# EAGLE design omaha_final (EAGLE 7.5.0)
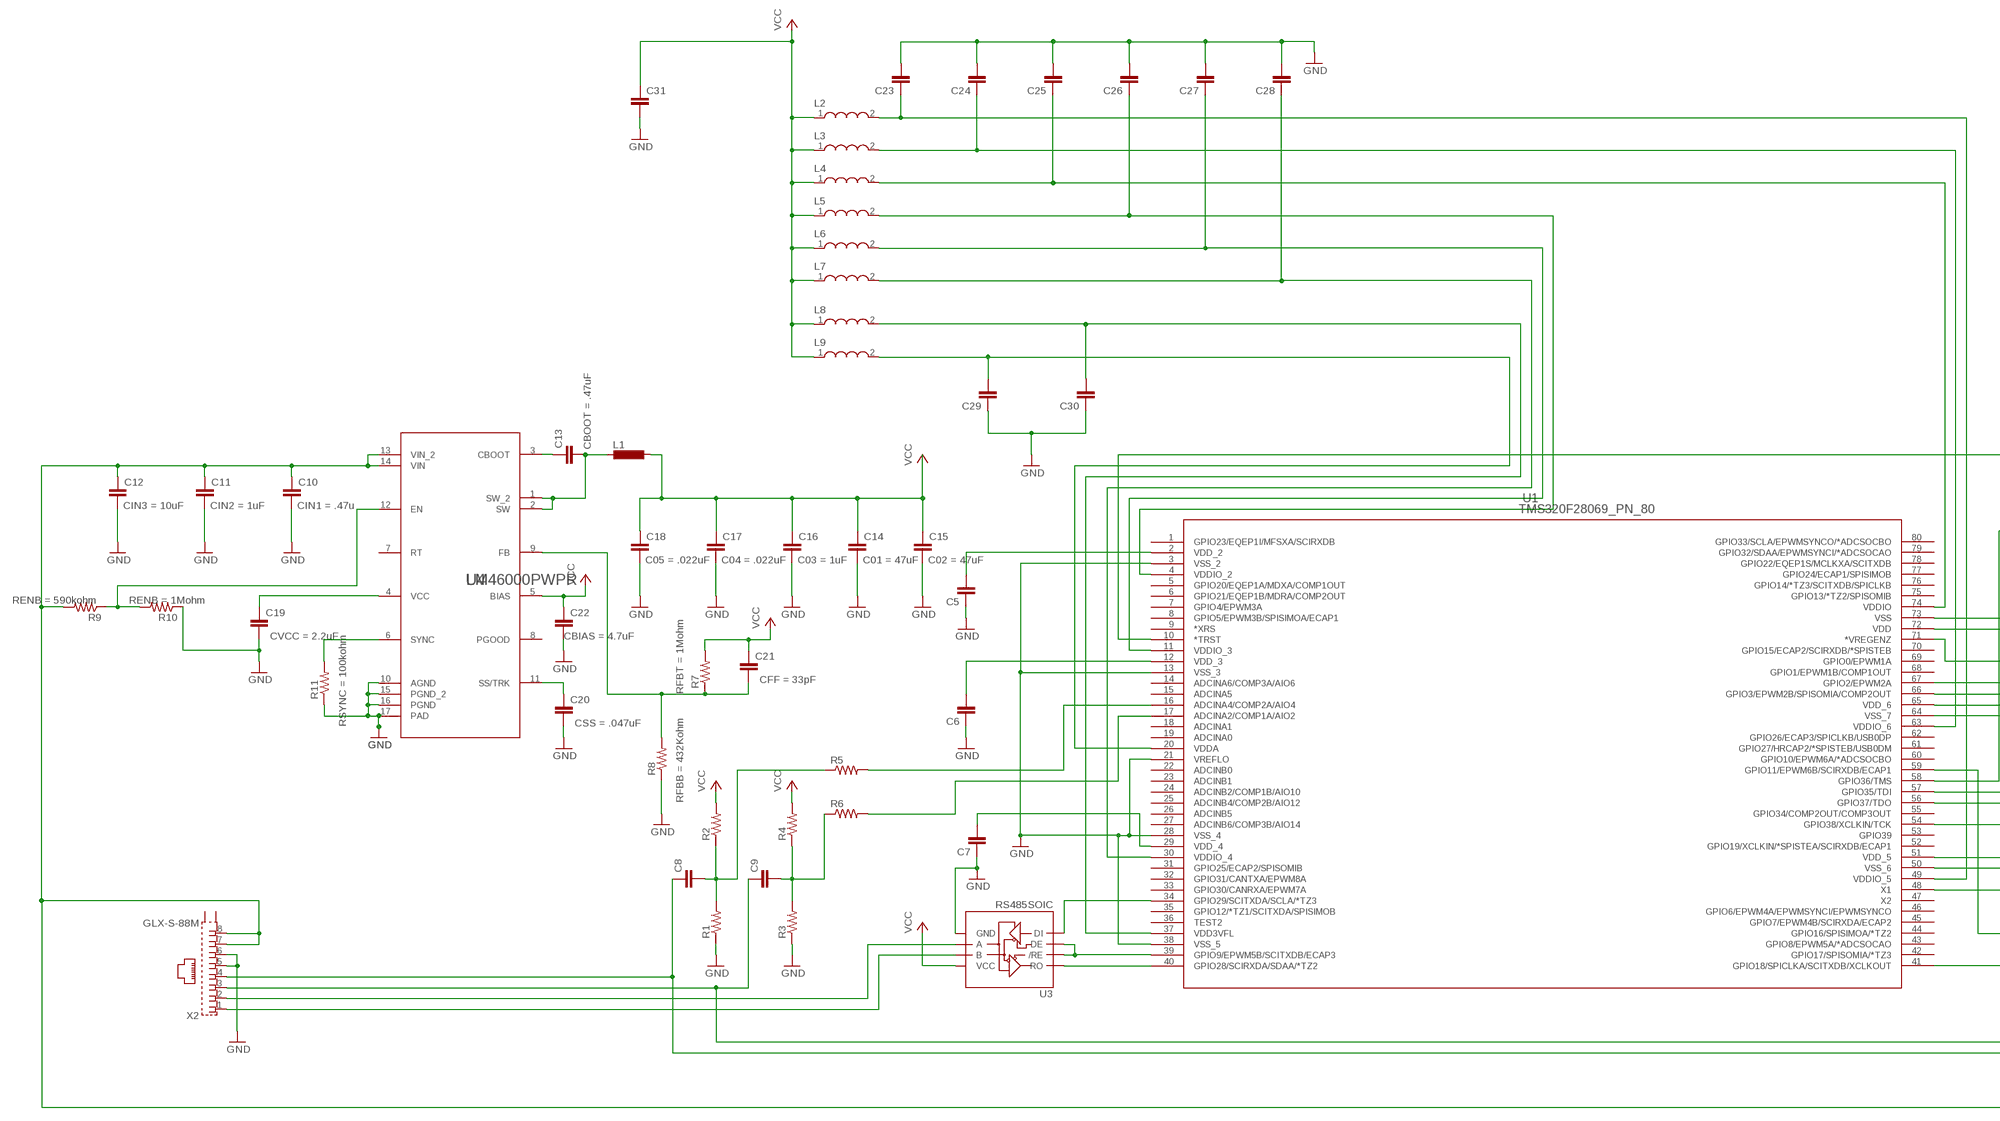
[diagram p0: schematic, sheet 1, part 1 of 2]
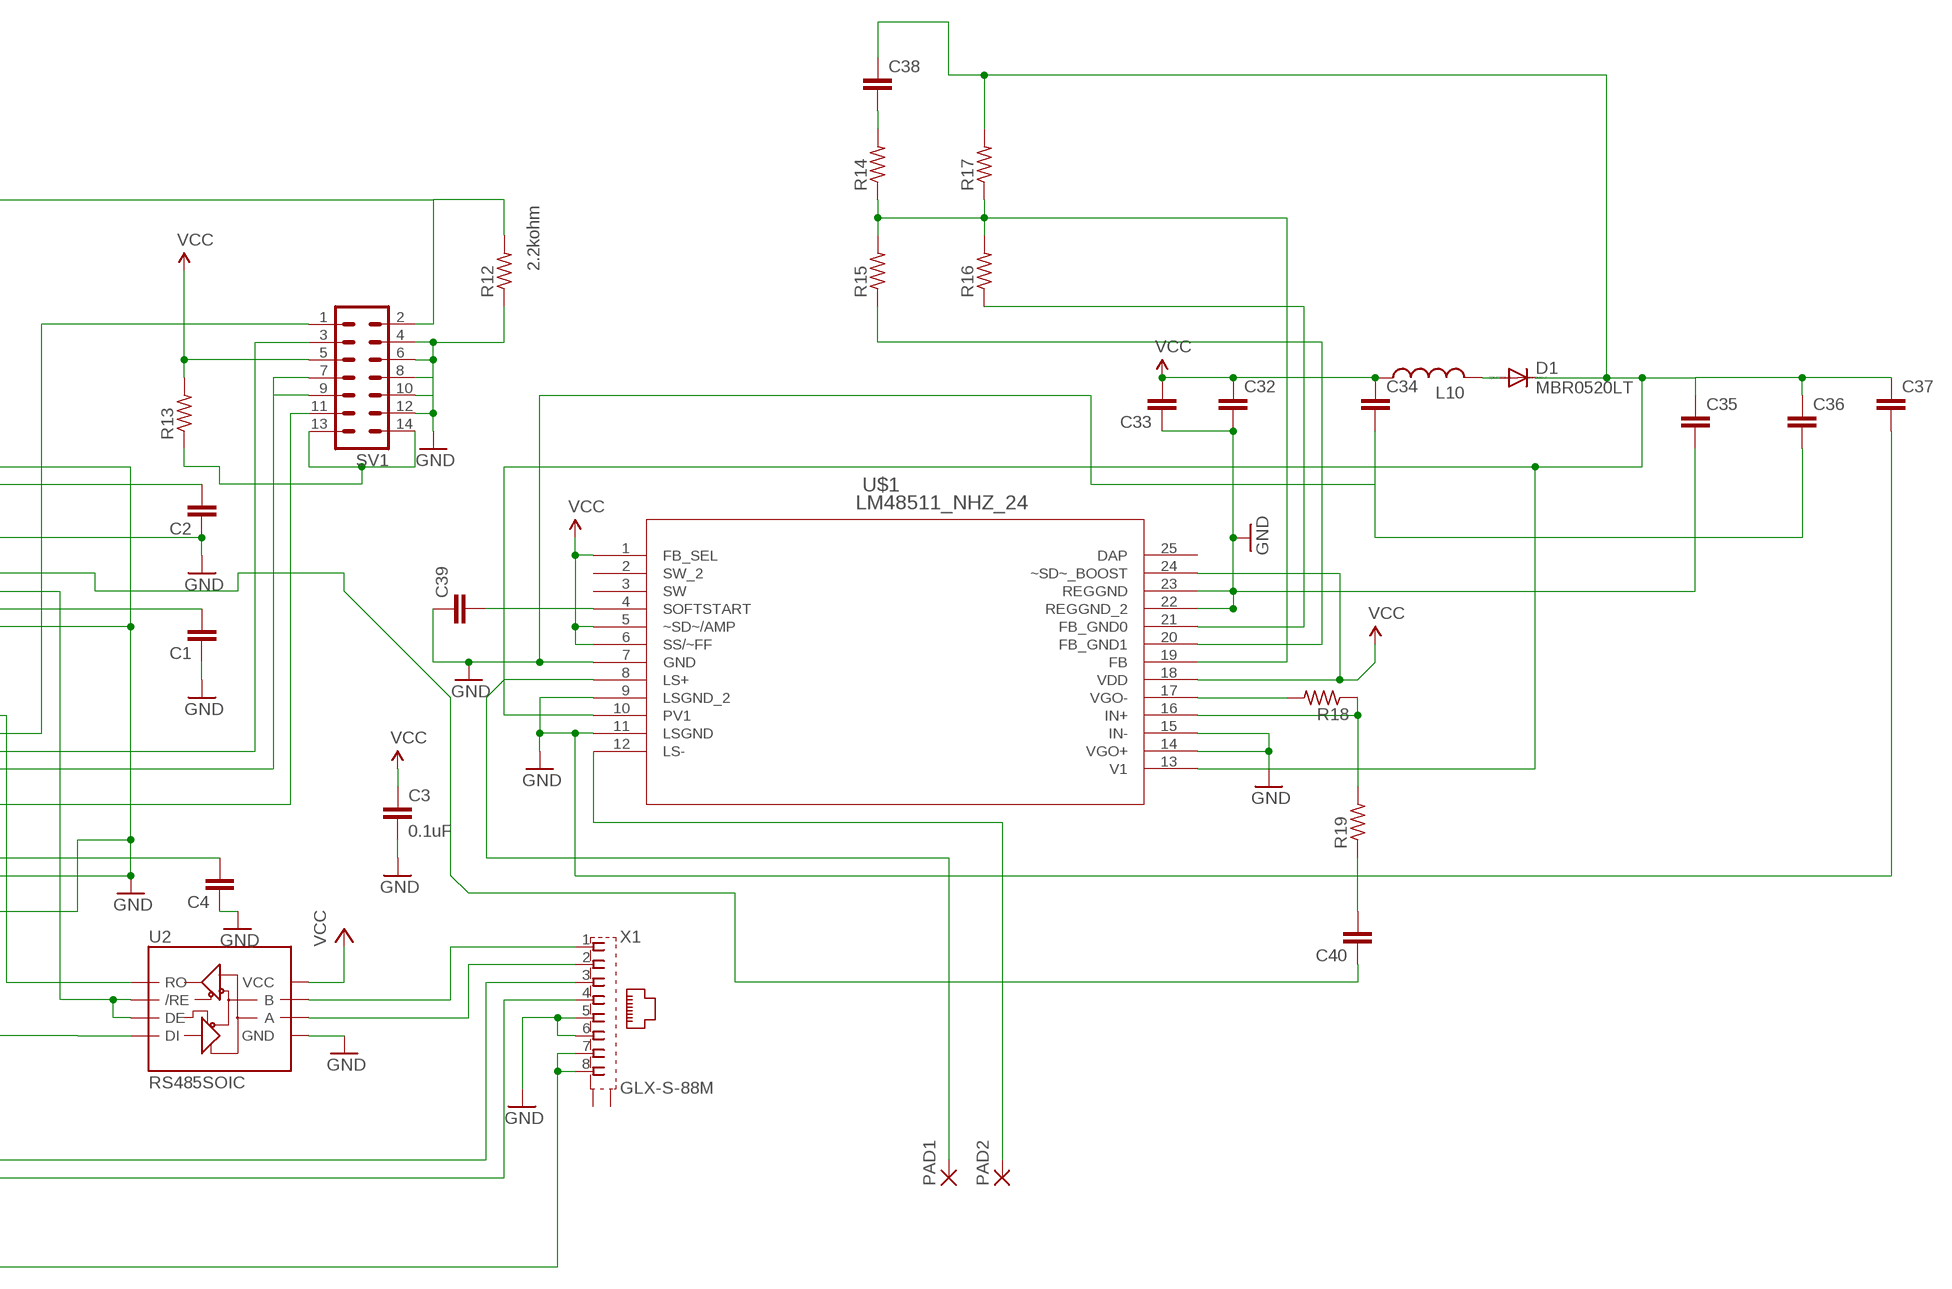
[diagram p1: schematic, sheet 1, part 2 of 2]

## Parts
C1  C-EUC0603  [C0603]
C2  C-EUC0603  [C0603]
C3  0.1uF  0.1UF-25V(+80/-20%)(0603)  [0603-CAP]
C4  C-EUC0603  [C0603]
C5  C-EUC0603  [C0603]
C6  C-EUC0603  [C0603]
C7  C-EUC0603  [C0603]
C8  C-EUC0603  [C0603]
C9  C-EUC0603  [C0603]
C10  C-EUC0805  [C0805]
C11  C-EUC1210  [C1210]
C12  C-EUC2220K  [C2220K]
C13  C-EUC0805  [C0805]
C14  C-EUC1210  [C1210]
C15  C-EUC1210  [C1210]
C16  C-EUC0805  [C0805]
C17  C-EUC0805  [C0805]
C18  C-EUC0805  [C0805]
C19  C-EUC0603  [C0603]
C20  C-EUC0603  [C0603]
C21  C-EUC0603  [C0603]
C22  C-EUC0805  [C0805]
C23  C-EUC0603  [C0603]
C24  C-EUC0603  [C0603]
C25  C-EUC0603  [C0603]
C26  C-EUC0603  [C0603]
C27  C-EUC0603  [C0603]
C28  C-EUC0603  [C0603]
C29  C-EUC0603  [C0603]
C30  C-EUC0603  [C0603]
C31  C-EUC0603  [C0603]
C32  C-EUC0805  [C0805]
C33  C-EUC0805  [C0805]
C34  C-EUC0805  [C0805]
C35  C-EUC0805  [C0805]
C36  C-EUC0805  [C0805]
C37  C-EUC0805  [C0805]
C38  C-EUC0805  [C0805]
C39  C-EUC0805  [C0805]
C40  C-EUC0805  [C0805]
D1  MBR0520LT  [SOD123]
L1  DO3316P  [DO3316P]
L2  WE-KI_0805A  [WE-KI_0805A]
L3  WE-KI_0805A  [WE-KI_0805A]
L4  WE-KI_0805A  [WE-KI_0805A]
L5  WE-KI_0805A  [WE-KI_0805A]
L6  WE-KI_0805A  [WE-KI_0805A]
L7  WE-KI_0805A  [WE-KI_0805A]
L8  WE-KI_0805A  [WE-KI_0805A]
L9  WE-KI_0805A  [WE-KI_0805A]
L10  L-USL5650M  [L5650M]
PAD1  3,81/1,4  [3,81/1,4]
PAD2  3,81/1,4  [3,81/1,4]
R1  R-US_R0603  [R0603]
R2  R-US_R0603  [R0603]
R3  R-US_R0603  [R0603]
R4  R-US_R0603  [R0603]
R5  R-US_R0603  [R0603]
R6  R-US_R0603  [R0603]
R7  R-US_R0603  [R0603]
R8  R-US_R0603  [R0603]
R9  R-US_R0603  [R0603]
R10  R-US_R0603  [R0603]
R11  R-US_R0603  [R0603]
R12  R-US_R0603  [R0603]
R13  R-US_R0603  [R0603]
R14  R-US_R0805  [R0805]
R15  R-US_R0805  [R0805]
R16  R-US_R0805  [R0805]
R17  R-US_R0805  [R0805]
R18  R-US_R0805  [R0805]
R19  R-US_R0805  [R0805]
SV1  MA07-2W  [MA07-2W]
U1  TMS320F28069_PN_80  [PN80]
U2  RS485SOIC  [SO08]
U3  RS485SOIC  [SO08]
U4  LM46000PWPR  [PWP0016F]
U$1  LM48511_NHZ_24  [SQA24B]
X1  GLX-S-88M  [GLX-S-88M]
X2  GLX-S-88M  [GLX-S-88M]

## Nets
GND [power]: C1.1 C2.1 C3.2 C4.1 C5.1 C6.1 C7.1 C10.2 C11.2 C12.2 C14.2 C15.2 C16.2 C17.2 C18.2 C19.2 C20.2 C22.2 C23.2 C24.2 C25.2 C26.2 C27.2 C28.2 C29.1 C30.1 C31.2 C32.2 C33.1 C34.2 C35.2 C36.2 C37.2 C39.1 R1.1 R3.1 R8.1 R10.1 R11.1 R12.1 SV1.4 SV1.6 SV1.8 SV1.10 SV1.12 U1.3(VSS_2) U1.13(VSS_3) U1.21(VREFLO) U1.28(VSS_4) U1.38(VSS_5) U1.48(X1) U1.50(VSS_6) U1.64(VSS_7) U1.71(*VREGENZ) U1.73(VSS) U2.5(GND) U3.5(GND) U4.10(AGND) U4.15(PGND_2) U4.16(PGND) U4.17(PAD) U$1.7(GND) U$1.9(LSGND_2) U$1.11(LSGND) U$1.14(VGO+) U$1.15(IN-) U$1.22(REGGND_2) U$1.23(REGGND) X1.5 X1.6 X2.5 X2.6
N$1: U1.59(GPIO11/EPWM6B/SCIRXDB/ECAP1) U2.1(RO)
N$2: U1.34(GPIO29/SCITXDA/SCLA/*TZ3) U3.4(DI)
N$4: U1.41(GPIO18/SPICLKA/SCITXDB/XCLKOUT) U2.4(DI)
N$5: U1.40(GPIO28/SCIRXDA/SDAA/*TZ2) U3.1(RO)
N$6: C1.2 U1.65(VDD_6)
N$7: C2.2 U1.72(VDD)
N$8: C4.2 U1.51(VDD_5)
N$9: C5.2 U1.2(VDD_2)
N$10: C6.2 U1.12(VDD_3)
N$11: C7.2 U1.29(VDD_4)
N$12: U2.7(B) X1.1
N$13: U2.6(A) X1.2
N$14: U3.7(B) X2.1
N$15: U3.6(A) X2.2
N$16: C9.1 X1.3 X2.3
N$17: C8.1 X1.4 X2.4
N$18: C8.2 R1.2 R2.1 R5.1
N$19: C9.2 R3.2 R4.1 R6.1
N$20: R6.2 U1.17(ADCINA2/COMP1A/AIO2)
N$21: R5.2 U1.16(ADCINA4/COMP2A/AIO4)
N$22: C13.2 L1.1 U4.1(SW_2) U4.2(SW)
N$23: C10.1 C11.1 C12.1 R9.2 U4.13(VIN_2) U4.14(VIN) X1.7 X1.8 X2.7 X2.8
N$24: C13.1 U4.3(CBOOT)
N$25: C19.1 U4.4(VCC)
N$26: C20.1 U4.11(SS/TRK)
N$27: C21.2 R7.1 R8.2 U4.9(FB)
N$28: R9.1 R10.2 U4.12(EN)
N$29: R11.2 U4.6(SYNC)
N$30: SV1.3 U1.57(GPIO35/TDI)
N$31: C24.1 L3.2 U1.63(VDDIO_6)
N$32: C28.1 L7.2 U1.30(VDDIO_4)
N$33: C25.1 L4.2 U1.74(VDDIO)
N$34: SV1.7 SV1.9 U1.56(GPIO37/TDO)
N$35: SV1.11 U1.54(GPIO38/XCLKIN/TCK)
N$36: C30.2 L8.2 U1.37(VDD3VFL)
N$37: R13.1 SV1.13 SV1.14
N$38: C27.1 L6.2 U1.11(VDDIO_3)
N$39: C26.1 L5.2 U1.4(VDDIO_2)
N$40: C29.2 L9.2 U1.20(VDDA)
N$41: C23.1 L2.2 U1.49(VDDIO_5)
N$42: R12.2 SV1.2 U1.10(*TRST)
N$44: SV1.1 U1.58(GPIO36/TMS)
N$45: U1.39(GPIO9/EPWM5B/SCITXDB/ECAP3) U3.2(/RE) U3.3(DE)
N$46: D1.A L10.2
N$47: C35.1 C36.1 C37.1 C38.1 D1.C R17.2 U$1.10(PV1) U$1.13(V1)
N$50: C40.2 R19.1
N$52: C38.2 R14.2
N$53: R14.1 R15.2 R16.2 R17.1 U$1.19(FB)
N$54: C40.1 U1.67(GPIO2/EPWM2A)
N$55: R16.1 U$1.21(FB_GND0)
N$56: R15.1 U$1.20(FB_GND1)
N$57: C39.2 U$1.4(SOFTSTART)
N$58: R18.2 U$1.17(VGO-)
N$59: R18.1 R19.2 U$1.16(IN+)
N$61: PAD1.1(P) U$1.8(LS+)
N$62: PAD2.1(P) U$1.12(LS-)
RTS: U1.66(GPIO3/EPWM2B/SPISOMIA/COMP2OUT) U2.2(/RE) U2.3(DE)
VCC [power]: C3.1 C14.1 C15.1 C16.1 C17.1 C18.1 C21.1 C22.1 C31.1 C32.1 C33.2 C34.1 L1.2 L2.1 L3.1 L4.1 L5.1 L6.1 L7.1 L8.1 L9.1 L10.1 R2.2 R4.2 R7.2 R13.2 SV1.5 U2.8(VCC) U3.8(VCC) U4.5(BIAS) U$1.1(FB_SEL) U$1.5(~SD~/AMP) U$1.6(SS/~FF) U$1.18(VDD) U$1.24(~SD~_BOOST)
Unconnected: U1.1(GPIO23/EQEP1I/MFSXA/SCIRXDB) U1.5(GPIO20/EQEP1A/MDXA/COMP1OUT) U1.6(GPIO21/EQEP1B/MDRA/COMP2OUT) U1.7(GPIO4/EPWM3A) U1.8(GPIO5/EPWM3B/SPISIMOA/ECAP1) U1.9(*XRS) U1.14(ADCINA6/COMP3A/AIO6) U1.15(ADCINA5) U1.18(ADCINA1) U1.19(ADCINA0) U1.22(ADCINB0) U1.23(ADCINB1) U1.24(ADCINB2/COMP1B/AIO10) U1.25(ADCINB4/COMP2B/AIO12) U1.26(ADCINB5) U1.27(ADCINB6/COMP3B/AIO14) U1.31(GPIO25/ECAP2/SPISOMIB) U1.32(GPIO31/CANTXA/EPWM8A) U1.33(GPIO30/CANRXA/EPWM7A) U1.35(GPIO12/*TZ1/SCITXDA/SPISIMOB) U1.36(TEST2) U1.42(GPIO17/SPISOMIA/*TZ3) U1.43(GPIO8/EPWM5A/*ADCSOCAO) U1.44(GPIO16/SPISIMOA/*TZ2) U1.45(GPIO7/EPWM4B/SCIRXDA/ECAP2) U1.46(GPIO6/EPWM4A/EPWMSYNCI/EPWMSYNCO) U1.47(X2) U1.52(GPIO19/XCLKIN/*SPISTEA/SCIRXDB/ECAP1) U1.53(GPIO39) U1.55(GPIO34/COMP2OUT/COMP3OUT) U1.60(GPIO10/EPWM6A/*ADCSOCBO) U1.61(GPIO27/HRCAP2/*SPISTEB/USB0DM) U1.62(GPIO26/ECAP3/SPICLKB/USB0DP) U1.68(GPIO1/EPWM1B/COMP1OUT) U1.69(GPIO0/EPWM1A) U1.70(GPIO15/ECAP2/SCIRXDB/*SPISTEB) U1.75(GPIO13/*TZ2/SPISOMIB) U1.76(GPIO14/*TZ3/SCITXDB/SPICLKB) U1.77(GPIO24/ECAP1/SPISIMOB) U1.78(GPIO22/EQEP1S/MCLKXA/SCITXDB) U1.79(GPIO32/SDAA/EPWMSYNCI/*ADCSOCAO) U1.80(GPIO33/SCLA/EPWMSYNCO/*ADCSOCBO) U4.7(RT) U4.8(PGOOD) U$1.2(SW_2) U$1.3(SW) X1.S1 X1.S2 X2.S1 X2.S2

## Power pins joined to a net without a drawn wire
DAP: U$1.25(DAP)

## Library data of the parts
C1 C2 C4-C9 C23-C40 = resistor:C-EU: CAPACITOR, European symbol
C3 = SparkFun-Capacitors:0.1UF-25V(+80/-20%)(0603): CAP-00810 Ceramic Standard decoupling cap; PROD_ID: CAP-00810
C10 = resistor:C-EU: CAPACITOR, European symbol; CIN1: .47u
C11 = resistor:C-EU: CAPACITOR, European symbol; CIN2: 1uF
C12 = resistor:C-EU: CAPACITOR, European symbol; CIN3: 10uF
C13 = resistor:C-EU: CAPACITOR, European symbol; CBOOT: .47uF
C14 = resistor:C-EU: CAPACITOR, European symbol; C01: 47uF
C15 = resistor:C-EU: CAPACITOR, European symbol; C02: 47uF
C16 = resistor:C-EU: CAPACITOR, European symbol; C03: 1uF
C17 = resistor:C-EU: CAPACITOR, European symbol; C04: .022uF
C18 = resistor:C-EU: CAPACITOR, European symbol; C05: .022uF
C19 = resistor:C-EU: CAPACITOR, European symbol; CVCC: 2.2uF
C20 = resistor:C-EU: CAPACITOR, European symbol; CSS: .047uF
C21 = resistor:C-EU: CAPACITOR, European symbol; CFF: 33pF
C22 = resistor:C-EU: CAPACITOR, European symbol; CBIAS: 4.7uF
D1 = diode:MBR0520LT: SCHOTTKY BARRIER RECTIFIER Source: http://onsemi.com .. MBR0520LT1-D.pdf
L1 = inductor-coilcraft:DO3316P: COILCRAFT; OC_FARNELL: unknown; OC_NEWARK: unknown
L2-L9 = EagleLibrary_Wuerth_Elektronik_eiSos_rev15h:WE-KI: SMD Wire Wound Ceramic Inductor Characteristics WE-KI series offers you an excellent Q factor and highest possible self resonant frequencies up to 12.5 GHz Inductance tolerances: 5% (2% on request) High thermal stability Operating temperature: –40°C to +125°C Applications Especially developed for high frequency applications RF transceiver/communications Bluetooth Wireless LAN <http://katalog.we-online.de/media/images/eisos/RfKI_pf2.jpg> Details see: http://katalog.we-online.de/en/pbs/WE-KI Updated by Dan Xu 2014-07-08 2014 (C) Wurth Elektronik
L10 = resistor:L-US: INDUCTOR, American symbol
PAD1 PAD2 = wirepad:3,81/1,4: THROUGH-HOLE PAD
R1-R6 R14-R19 = resistor:R-US_: RESISTOR, American symbol
R7 = resistor:R-US_: RESISTOR, American symbol; RFBT: 1Mohm
R8 = resistor:R-US_: RESISTOR, American symbol; RFBB: 432Kohm
R9 = resistor:R-US_: RESISTOR, American symbol; RENB: 590kohm
R10 = resistor:R-US_: RESISTOR, American symbol; RENB: 1Mohm
R11 = resistor:R-US_: RESISTOR, American symbol; RSYNC: 100kohm
R12 = resistor:R-US_: RESISTOR, American symbol; R12: 2.2kohm
R13 = resistor:R-US_: RESISTOR, American symbol; R13: 2.2kohm
SV1 = con-lstb:MA07-2W: PIN HEADER; OC_FARNELL: unknown; OC_NEWARK: unknown
U1 = tms320f28069:TMS320F28069_PN_80; DATASHEETURL: http://www.ti.com/lit/gpn/TMS320F28069; DESCRIPTION: Piccolo Microcontroller; FAMILY_NAME: 28X PICCOLO&#153 SERIES; GENERIC_PART_NUMBER: TMS320F28069; INDUSTRY_STD_PKG_TYPE: LQFP; MANUFACTURER: Texas Instruments; MANUFACTURER_PART_NUMBER: tms320f28069_pn_80; PACKAGE_DESIGNATOR: PN; PIN_COUNT: 80; VENDOR: Texas Instruments
U2 U3 = SparkFun:RS485
U4 = lm46000:LM46000PWPR; ADDRESS1: Not shown in title block; ADDRESS2: Not shown in title block; ADDRESS3: Not shown in title block; ADDRESS4: Not shown in title block; ALTERNATEMANUFACTURER: None; APPROVEDBY: Not shown in title block; AUTHOR: Not shown in title block; CHECKEDBY: Not shown in title block; COMPANYNAME: Not shown in title block; COMPONENTLINK1DESCRIPTION: Datasheet Link; COMPONENTLINK1URL: N/A; COMPTYPE: IC; CURRENTDATE: Not shown in title block; CURRENTTIME: Not shown in title block; DATE: Not shown in title block; DESIGNATOR: U?; DOCUMENTFULLPATHANDNAME: Not shown in title block; DOCUMENTNAME: Not shown in title block; DOCUMENTNUMBER: 1; ENGINEER: Not shown in title block; IMAGEPATH: Not shown in title block; LATESTREVISIONDATE: 2014-02-20; MANUFACTURER: Texas Instruments; MODIFIEDDATE: Not shown in title block; MOUNTTYPE: SMT; ORGANIZATION: Not shown in title block; PACKAGEREFERENCE: PWP0016F; PARTNUMBER: LM46000PWP; PIN_COUNT: 17; PROJECTNAME: *; PUBLISHER: Texas Instruments; REVISION: Use project parameter SCH_Rev; ROHS: Y; RULE: *; SHEETNUMBER: 1; SHEETTOTAL: 1; SYMBOLCREATOR: x0208326; SYMBOLVERSION: 2014-02-14; TIME: Not shown in title block
U$1 = amp:LM48511_NHZ_24; MANUFACTURER_PART_NUMBER: lm48511sqnopb; VENDOR: National
X1 X2 = con-kycon:GLX-S-88M: Mod. Jack, Right Angle, 8 posiotion, 8 contatcs RJ45 Source: GLX-S-88M.pdf; OC_FARNELL: unknown; OC_NEWARK: unknown

## Net classes
0 default: width 0.203 mm
1 power: width 0.254 mm

## Board
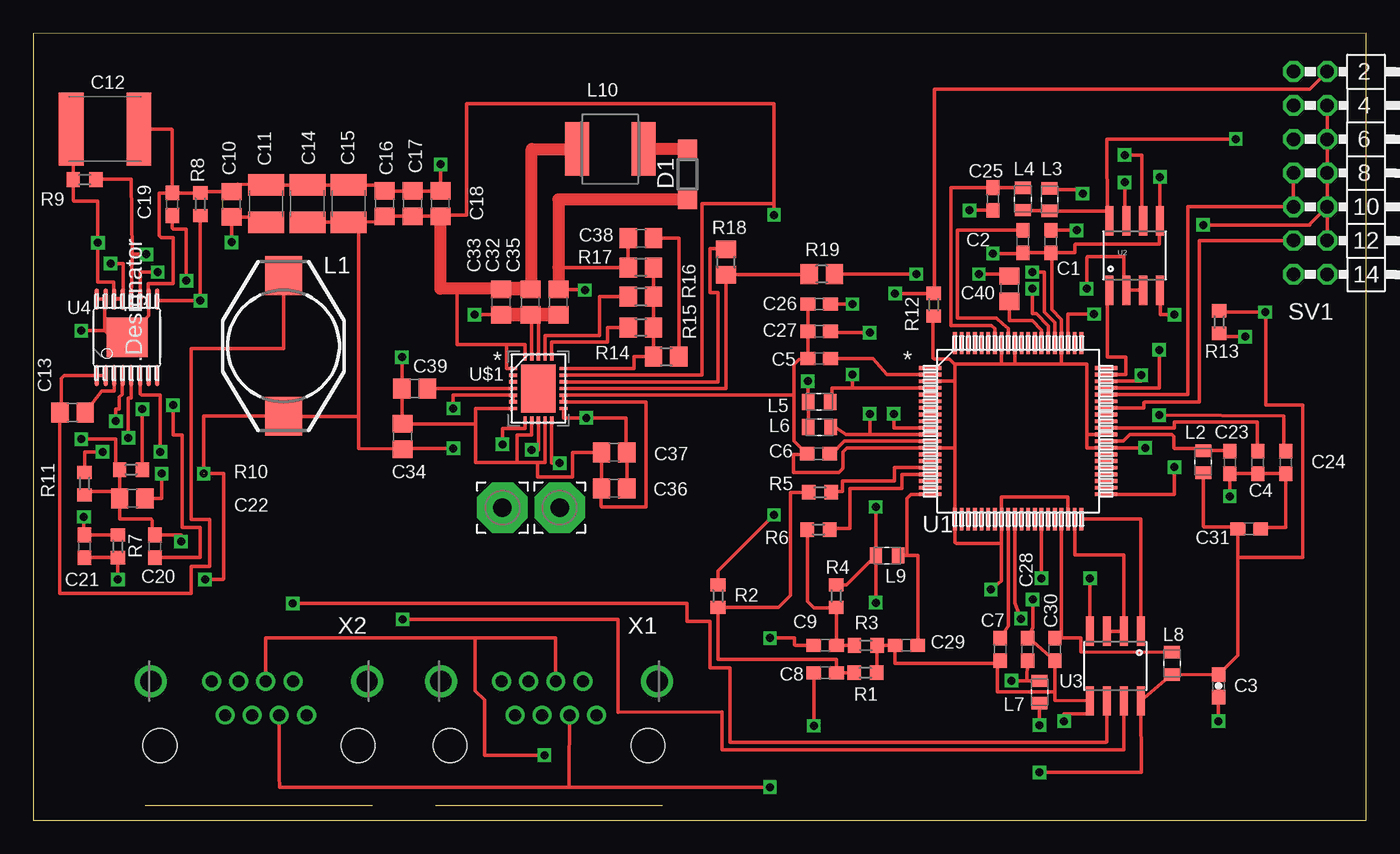
[diagram p2: board, top side]
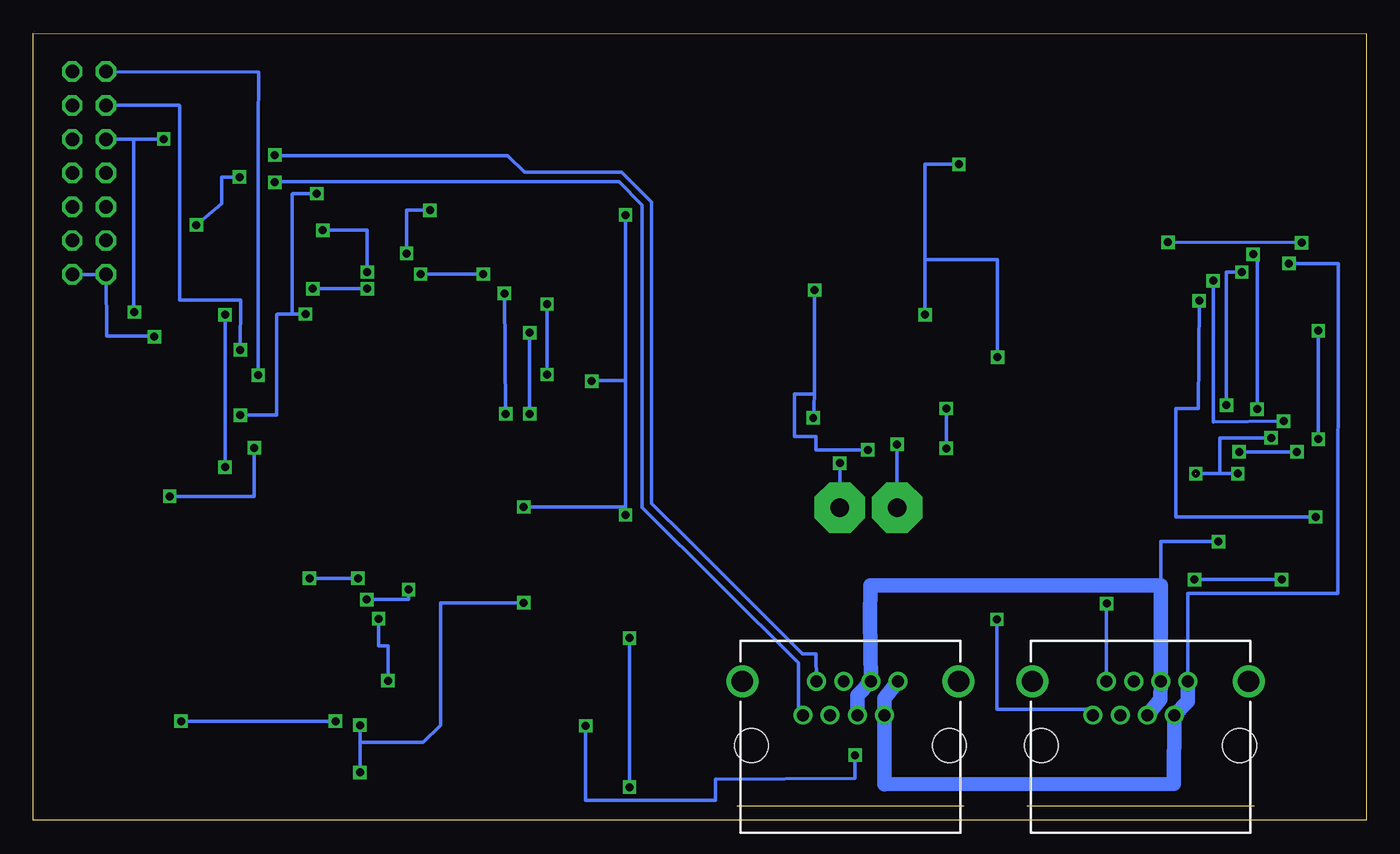
[diagram p3: board, bottom side, seen from below]

Size 100.15 x 59.15 mm. Coordinates in mm from the lower left corner, seen from the top.
Outline: 0,0 100.15,0 100.15,59.15 0,59.1 0,0
Copper layers (1*16): Top 0.035mm / dielectric 1.5mm / Bottom 0.035mm
Design rules "default *": minimum track width 10mil, minimum drill 24mil, track to track 8mil, track to pad 8mil, pad to pad 8mil, via to via 8mil, smd to smd 8mil, copper to edge 40mil, drill to drill 8mil, minimum pad ring 10mil, minimum via ring 8mil, stop-mask expansion 4mil, vias tented up to drill 0mil, thermal gap 10mil

### Footprints (pad centres in the part's own frame; a part is rotated, then mirrored left to right if it is on the bottom)
C0603 = smd 1.1 x 1: 1 -0.85,0; 2 0.85,0
0603-CAP = smd 1.1 x 1: 1 -0.85,0; 2 0.85,0
C0805 = smd 1.3 x 1.5: 1 -0.95,0; 2 0.95,0
C1210 = smd 1.6 x 2.7: 1 -1.4,0; 2 1.4,0
C2220K = smd 1.85 x 5.5: 1 -2.55,0; 2 2.55,0
SOD123 = smd 1.4 x 1.4: A 1.9,0; C -1.9,0
DO3316P = smd 2.92 x 2.79: 1 -5.28,0; 2 5.28,0
WE-KI_0805A = smd 0.925 x 1.2: 1 -0.838,0; 2 0.838,0
L5650M = smd 1.8 x 4: 1 -2.5,0; 2 2.5,0
3,81/1,4 = drill 1.397 pad 3.81 octagon: 1 0,0
R0603 = smd 1 x 1.1: 1 -0.85,0; 2 0.85,0
R0805 = smd 1.3 x 1.5: 1 -0.95,0; 2 0.95,0
MA07-2W = drill 1.016 octagon: 1 -7.62,-1.27; 2 -7.62,1.27; 3 -5.08,-1.27; 4 -5.08,1.27; 5 -2.54,-1.27; 6 -2.54,1.27; 7 0,-1.27; 8 0,1.27; 9 2.54,-1.27; 10 2.54,1.27; 11 5.08,-1.27; 12 5.08,1.27; 13 7.62,-1.27; 14 7.62,1.27
PN80 = smd 1.676 x 0.279: 1 -6.617,4.75; 2 -6.617,4.25; 3 -6.617,3.75; 4 -6.617,3.25; 5 -6.617,2.75; 6 -6.617,2.25; 7 -6.617,1.75; 8 -6.617,1.25; 9 -6.617,0.75; 10 -6.617,0.25; 11 -6.617,-0.25; 12 -6.617,-0.75; 13 -6.617,-1.25; 14 -6.617,-1.75; 15 -6.617,-2.25; 16 -6.617,-2.75; 17 -6.617,-3.25; 18 -6.617,-3.75; 19 -6.617,-4.25; 20 -6.617,-4.75; 41 6.617,-4.75; 42 6.617,-4.25; 43 6.617,-3.75; 44 6.617,-3.25; 45 6.617,-2.75; 46 6.617,-2.25; 47 6.617,-1.75; 48 6.617,-1.25; 49 6.617,-0.75; 50 6.617,-0.25; 51 6.617,0.25; 52 6.617,0.75; 53 6.617,1.25; 54 6.617,1.75; 55 6.617,2.25; 56 6.617,2.75; 57 6.617,3.25; 58 6.617,3.75; 59 6.617,4.25; 60 6.617,4.75 | smd 0.279 x 1.676: 21 -4.75,-6.617; 22 -4.25,-6.617; 23 -3.75,-6.617; 24 -3.25,-6.617; 25 -2.75,-6.617; 26 -2.25,-6.617; 27 -1.75,-6.617; 28 -1.25,-6.617; 29 -0.75,-6.617; 30 -0.25,-6.617; 31 0.25,-6.617; 32 0.75,-6.617; 33 1.25,-6.617; 34 1.75,-6.617; 35 2.25,-6.617; 36 2.75,-6.617; 37 3.25,-6.617; 38 3.75,-6.617; 39 4.25,-6.617; 40 4.75,-6.617; 61 4.75,6.617; 62 4.25,6.617; 63 3.75,6.617; 64 3.25,6.617; 65 2.75,6.617; 66 2.25,6.617; 67 1.75,6.617; 68 1.25,6.617; 69 0.75,6.617; 70 0.25,6.617; 71 -0.25,6.617; 72 -0.75,6.617; 73 -1.25,6.617; 74 -1.75,6.617; 75 -2.25,6.617; 76 -2.75,6.617; 77 -3.25,6.617; 78 -3.75,6.617; 79 -4.25,6.617; 80 -4.75,6.617
SO08 = smd 0.61 x 2.21: 1 -1.905,-2.616; 2 -0.635,-2.616; 3 0.635,-2.616; 4 1.905,-2.616; 5 1.905,2.616; 6 0.635,2.616; 7 -0.635,2.616; 8 -1.905,2.616
PWP0016F = smd 1.651 x 0.356: 1 -2.875,2.275; 2 -2.875,1.625; 3 -2.875,0.975; 4 -2.875,0.325; 5 -2.875,-0.325; 6 -2.875,-0.975; 7 -2.875,-1.625; 8 -2.875,-2.275; 9 2.875,-2.275; 10 2.875,-1.625; 11 2.875,-0.975; 12 2.875,-0.325; 13 2.875,0.325; 14 2.875,0.975; 15 2.875,1.625; 16 2.875,2.275 | smd 2.997 x 3.099: 17 0,0 | smd 0.406 x 0.406: V -1,0
SQA24B = smd 0.61 x 0.254: 1 -1.905,1.5; 2 -1.905,1; 3 -1.905,0.5; 4 -1.905,0; 5 -1.905,-0.5; 6 -1.905,-1; 7 -1.905,-1.5; 13 1.905,-1.5; 14 1.905,-1; 15 1.905,-0.5; 16 1.905,0; 17 1.905,0.5; 18 1.905,1; 19 1.905,1.5 | smd 0.254 x 0.61: 8 -1,-2.4; 9 -0.5,-2.4; 10 0,-2.4; 11 0.5,-2.4; 12 1,-2.4; 20 1,2.4; 21 0.5,2.4; 22 0,2.4; 23 -0.5,2.4; 24 -1,2.4 | smd 2.591 x 3.607: 25 0,0
GLX-S-88M = drill 0.9 pad 1.422: 1 -3.57,-2.3; 2 -2.55,-4.84; 3 -1.53,-2.3; 4 -0.51,-4.84; 5 0.51,-2.3; 6 1.53,-4.84; 7 2.55,-2.3; 8 3.57,-4.84 | drill 1.6 pad 2.184: S1 -8.125,-4.84; S2 8.125,-4.84 | hole 2.55: -7.44,0; 7.44,0

### Placement (x,y rotation side)
C1  76.45,43.5 90 top
C2  74.35,43.5 90 top
C3  89.05,10.1 270 top
C4  92,26.9 90 top
C5  59.05,34.7 0 top
C6  59,27.55 0 top
C7  72.65,12.85 90 top
C8  59.5,11.09 0 top
C9  59.5,13.15 0 top
C10  14.9,46.3 90 top
C11  17.5,46.35 90 top
C12  5.4,51.95 0 top
C13  2.95,30.65 180 top
C14  20.6,46.35 90 top
C15  23.7,46.35 90 top
C16  26.4,46.35 90 top
C17  28.5,46.35 90 top
C18  30.6,46.35 90 top
C19  10.45,46.3 90 top
C20  9.15,20.6 90 top
C21  3.85,20.6 90 top
C22  7.45,24.2 180 top
C23  89.9,26.9 270 top
C24  94.1,26.9 270 top
C25  72.1,46.7 270 top
C26  59.05,38.8 180 top
C27  59.05,36.75 180 top
C28  74.7,12.85 90 top
C29  65.6,13.15 0 top
C30  76.75,12.85 90 top
C31  91.35,21.9 0 top
C32  37.35,38.95 270 top
C33  35.15,38.95 90 top
C34  27.75,28.85 90 top
C35  39.45,38.95 270 top
C36  43.65,24.95 180 top
C37  43.65,27.65 180 top
C38  45.65,43.75 0 top
C39  28.65,32.45 0 top
C40  73.35,39.95 90 top
D1  49.15,48.55 90 top
L1  18.8,35.65 270 top
L2  87.9,26.95 90 top
L3  76.35,46.65 90 top
L4  74.35,46.7 90 top
L5  59.05,31.45 0 top
L6  59.07,29.55 0 top
L7  75.6,9.65 90 top
L8  85.55,11.8 90 top
L9  64.15,19.9 0 top
L10  43.35,50.45 0 top
PAD1  35.25,23.5 0 top
PAD2  39.55,23.5 0 top
R1  62.52,11.1 180 top
R2  51.45,16.85 90 top
R3  62.55,13.15 180 top
R4  60.34,16.85 90 top
R5  59.1,24.65 0 top
R6  59,21.85 0 top
R7  6.35,20.6 270 top
R8  12.55,46.3 270 top
R9  3.85,48.15 180 top
R10  7.35,26.35 0 top
R11  3.85,25.3 90 top
R12  67.65,38.75 90 top
R13  89.1,37.45 90 top
R14  47.55,34.85 0 top
R15  45.65,37.05 0 top
R16  45.65,39.35 0 top
R17  45.65,41.55 180 top
R18  52.05,41.95 90 top
R19  59.25,41.05 180 top
SV1  95.95,48.65 270 top
U1  74,29.25 0 top
U2  82.75,42.45 0 top
U3  81.3,11.6 180 top
U4  7.05,36.3 90 top
U$1  37.95,32.45 0 top
X1  38.75,5.61 180 top
X2  16.96,5.61 180 top

### Tracks (layer width: path | path; a pad name or v marks a point on that pad's centre or on a via)
GND  (via drill 0.6, 0.6 pad 0.25)
  Top 0.254: C36.2 42.65,24.65 42.65,23.65 42.7,23.55
  Top 0.28: 57.15,31.85 57.15,28.5 58.15,27.5 C6.1 58.1,27.5 57.1,27.5 57.1,26.15 60.55,26.15 60.8,26.4 60.85,26.5 60.85,27.7 61.15,28 U1.13 | 57.15,31.85 57.15,34.25 57.53,34.63 C5.1 C27.2 C26.2 | R1.1 63.4,11.13 R3.1 C29.1 64.75,11.8 72.4,11.8 72.38,11.82 C7.1 72.45,12 72.45,9.65 76.75,9.65 | v75.1,16.6 75.1,14.46 C28.2 75.09,13.44 C30.1 76.74,11.19 76.75,9.65 | v71.95,17.35 72.75,18 72.75,20.8 | 72.75,20.8 U1.28 | 76.75,9.65 76.75,9 U3.5 79.45,8.93 79.45,8.15 79.3,8 77.45,8 v77.45,7.45 | v89.05,7.45 C3.2 | 94.1,25.3 C24.2 | C24.2 C4.1 C23.2 v89.9,24.35 | v83.55,28 | v83.55,28 U1.48 | C31.2 92.3,22 94.1,22 C24.2 | U1.38 | U1.38 77.75,24.3 72.75,24.3 U1.28 | U1.21 | U1.21 69.25,20.9 69.35,20.8 72.75,20.8 | U1.28 | U1.21 | U1.21 69.25,28 | U1.13 | U1.13 69.25,28 | 69.25,34.25 69.25,33 | 69.25,33 69.25,28 | 72.75,34.3 | 72.75,34.3 U1.73 | U1.71 | U1.71 73.75,34.3 | 73.75,34.3 72.75,34.3 | U1.64 | U1.64 77.25,34.3 | 77.25,34.3 73.75,34.3 | 69.25,34.25 69.3,34.3 72.75,34.3 | U1.3 | U1.3 69.25,33 | U1.50 | U1.50 79.15,29 | 79.15,29 79.15,34.3 77.25,34.3 | U1.48 | U1.48 79.15,28 79.15,29 | SV1.10 SV1.8 SV1.6 SV1.4 | SV1.10 SV1.12 | U1.64 | U1.64 77.25,37.65 76.55,38.4 76.55,42.15 C1.1 | C1.1 C2.1 74.3,42.6 v72.1,42.6 | v70.35,45.85 C25.2 | R12.1 67.6,37.85 67.6,34.75 67.7,34.65 68.85,34.65 69.25,34.25 | SV1.10 95.9,44.79 95.9,44.75 v87.9,44.75 | v84.65,48.35 v84.66,48.34 U2.5 84.6,45.01 84.6,43.3 78.3,43.3 78.25,43.25 78.25,42.65 C1.1 | U4.16 U4.15 5.35,39.1 5.35,36.8 | 5.35,36.8 5.85,36.3 U4.17 8.68,37.92 U4.10 8.7,39.2 8.65,39.25 8.65,40.35 10.5,40.35 10.5,43.8 9.6,43.8 9.45,43.95 9.45,47.15 C19.2 | C19.2 R8.1 12.65,47.25 C10.2 15.35,47.8 C11.2 C14.2 C15.2 25.75,47.75 C16.2 C17.2 C18.2 v30.6,49.3
  Top 0.28: C12.2 10.4,51.95 10.45,51.9 C19.2 | v3.6,28.65 6.2,28.65 6.2,26.45 R10.1 6.5,24.7 | v3.6,36.8 5.35,36.8 | 6.5,24.7 C22.2 6.5,22.65 8.85,22.65 8.95,22.55 8.95,21.65 C20.2 11.1,21.45 v11.1,20.95 | R11.1 4.1,24.7 6.5,24.7 | U$1.15 U$1.14 | U$1.14 U$1.15 57.05,31.95 57.15,31.85 | U$1.23 37.45,37.45 | 37.45,37.45 C32.2 | U$1.22 37.95,37.45 37.45,37.45 | 33.25,29.8 C34.2 27.7,29.8 C39.1 v27.7,34.8 | 33.25,29.8 33.25,30.95 U$1.7 | U$1.7 | U$1.9 37.45,28.95 36.35,28.95 36.35,26.9 | 36.35,26.9 37.95,26.9 | 37.95,26.9 38.45,26.9 U$1.11 | 36.35,26.9 33.25,26.9 33.25,29.8 | C36.2 C37.2 40.5,27.65 40.5,25.8 37.9,25.8 37.9,26.85 37.95,26.9 | U$1.14 46.05,31.45 | 46.05,31.45 | 46.05,31.45 46.05,23.55 42.7,23.55 | C33.1 v33.15,38
  Top 1: C33.1 C32.2 C35.2
  Bottom 0.28: v75.1,16.6 71.95,16.6 v71.95,17.35 | v89.9,24.35 83.55,24.35 v83.55,28 | v72.1,42.6 C25.2 v70.35,45.85 | v87.9,44.75 86,46.35 86,48.35 v84.65,48.35 | v3.6,28.65 v3.6,36.8 | v77.45,7.45 v89.05,7.45 | v11.1,20.95 15.45,20.95 15.45,17.65 | 15.45,10.47 X2.6 | v33.15,38 33.15,42.15 | 33.15,42.15 33.15,49.3 v30.6,49.3 | 33.15,42.15 27.7,42.15 v27.7,34.8
  Bottom 1.1: 15.45,10.47 15.45,17.65 37.25,17.65 37.27,15.17 X1.6 38.24,9.38 X1.5 | X2.6 15.48,9.08 X2.5
N$1
  Top 0.28: U1.59 | U1.59 82.1,33.5 82.1,34.8 80.7,34.8 80.7,38.75 80.73,38.77 U2.1
N$2  (via drill 0.6)
  Top 0.28: U3.4 v79.4,18.2 | v75.75,18.2 | v75.75,18.2 U1.34
  Bottom 0.28: v79.4,18.2 v75.75,18.2
N$4  (via drill 0.6)
  Top 0.28: U1.41 | U1.41 85.75,24.5 v85.75,26.55 | v85.75,38 84.69,38.02 U2.4
  Bottom 0.28: v85.75,26.55 v85.75,38
N$5
  Top 0.28: U3.1 83.2,22.65 83.18,22.63 U1.40
N$6  (via drill 0.6)
  Top 0.28: U1.65 | U1.65 76.75,37.4 75.95,38.2 75.95,41.2 v75.05,41.2 | v78.4,44.35 C1.2
  Bottom 0.28: v75.05,41.2 75.05,44.35 v78.4,44.35
N$7
  Top 0.28: U1.72 73.25,36.8 73.25,36.95 72.85,37.3 72.35,37.75 69.45,37.75 69.45,44.35 C2.2
N$8
  Top 0.28: C4.2 91.95,27.8 91.95,29.5 | 91.95,29.5 | U1.51 85.75,29.5 85.75,29.95 91.95,29.95 91.95,29.5
N$9
  Top 0.28: U1.2 | U1.2 64.15,33.5 63.1,34.7 C5.2
N$10
  Top 0.28: U1.12 | U1.12 60.95,28.5 60,27.55 C6.2
N$11
  Top 0.28: C7.2 73.25,14.6 U1.29
N$12  (via drill 0.6)
  Top 0.28: U2.7 82,44.97 v82,47.95
  Bottom 0.28: v82,47.95 81.95,48 56.15,48 54.4,46.25 54.4,23.5 42.67,11.82 42.65,11.77 42.65,8.35 42.37,8.35 X1.1
N$13  (via drill 0.6)
  Top 0.28: U2.6 83.3,45.15 83.3,50 v82,50
  Bottom 0.28: v82,50 81.95,49.95 64.5,49.95 63.25,48.7 55.95,48.7 53.7,46.45 53.7,23.8 51,21.15 42.35,12.5 41.35,12.5 X1.2
N$14  (via drill 0.6)
  Top 0.28: U3.7 81.94,5.92 81.95,5.9 81.95,5.3 51.75,5.3 51.75,8.15 43.95,8.1 43.95,15.1 v27.75,15.1
  Bottom 0.28: v27.75,15.1 27.75,8.35 21,8.35 20.55,7.9 X2.1
N$15  (via drill 0.6)
  Top 0.28: v19.5,16.3 49.1,16.3 49.1,14.95 50.85,14.95 50.85,11.45 52.35,11.45 52.35,5.85 80.6,5.85 80.65,5.9 80.65,8.97 U3.6
  Bottom 0.28: X2.2 v19.51,16.29 v19.5,16.3
N$16  (via drill 0.6)
  Top 0.28: X2.3 18.49,3.31 18.5,2.5 40.25,2.5 | 40.25,2.5 40.25,3.39 X1.3 | 40.25,2.5 v55.35,2.5 | C9.1 57.25,13.15 57.2,13.2 57.2,13.7 v55.35,13.7
  Bottom 0.28: v55.35,2.5 v55.35,13.7
N$17  (via drill 0.6)
  Top 0.28: X2.4 17.47,13.72 17.45,13.7 33.3,13.7 | 33.3,13.7 39.25,13.7 X1.4 | C8.1 v58.65,7.1 | v38.4,4.9 33.9,4.9 33.9,9.05 33.2,9.75 33.2,13.6 33.3,13.7
  Bottom 0.28: v58.65,7.1 58.65,1.5 48.9,1.5 48.9,3.1 38.4,3.15 v38.4,4.9
N$18
  Top 0.28: R1.2 C8.2 60.35,12.1 51.45,12.1 R2.1 56,16 56.9,16.9 56.9,24.65 R5.1
N$19
  Top 0.28: R6.1 58.15,16.45 58.65,15.95 60.29,15.95 R4.1 C9.2 R3.2
N$20
  Top 0.28: R6.2 59.95,21.95 61.35,21.95 61.35,24.95 65.28,24.95 65.28,25.98 65.3,26 65.35,26 U1.17
N$21
  Top 0.28: U1.16 | R5.2 60,24.7 60.8,24.7 60.8,25.5 64.7,25.5 64.7,26.5 U1.16
N$22
  Top 0.28: U4.2 U4.1 2.33,33.42 2.1,33.2 2.1,30.75 C13.2 2,17.05 11.85,17.05 11.85,19.1 13.25,19.1 13.25,22.6 11.85,22.6 11.85,35.45 18.8,35.45 L1.1
N$23  (via drill 0.6)
  Top 0.28: C11.1 17.05,45.35 C10.1 v14.9,43.45 | U4.14 U4.13 | C12.1 3,51.85 R9.2 3,46.6 3.05,46.55 4.85,46.55 v4.85,43.4 4.85,40.45 6.05,40.45 6.05,39.3 6.1,39.25 6.05,39.2 6.7,39.2 U4.13 | U4.13 6.75,39.2 6.75,41.85 v5.8,41.85
  Bottom 0.28: v4.85,43.4 v14.9,43.45 | v5.8,41.85 2.1,41.85 2.15,17.05 13.4,17.05 13.39,15.16 X2.8 | 14.46,2.76 14.45,2.75
  Bottom 1.1: X2.8 13.39,8.93 X2.7 14.46,2.76 | 14.45,2.75 36.2,2.7 X1.7 36.2,9.18 X1.8
N$24
  Top 0.28: C13.1 5.15,32.25 6.05,32.25 6.08,32.27 U4.3
N$25  (via drill 0.6)
  Top 0.28: v11.5,40.55 11.5,44.45 10.5,44.45 10.45,44.5 C19.1 | v6.2,30 6.2,30.9 6.45,30.9 6.45,31.8 6.7,32 6.7,33.4 U4.4
  Bottom 0.28: v11.5,40.55 11.5,29.95 v6.2,30
N$26  (via drill 0.6)
  Top 0.28: 8.15,39.3 U4.11 8.05,39.2 8.05,41.2 v9.35,41.2 | C20.1 12.55,19.75 12.55,22 11.2,22 11.2,28.95 10.5,28.95 v10.5,31.2
  Bottom 0.28: v9.35,41.2 10.5,41.2 v10.5,31.2
N$27  (via drill 0.6)
  Top 0.28: 9.4,39.05 U4.9 9.33,39.35 9.4,39.05 | 9.4,39.05 v12.55,39.05 R8.2 | R7.1 C21.2 3.8,21.45 v3.8,22.8
  Bottom 0.28: v12.55,39.05 12.6,30.95 14.3,30.95 14.3,22.8 v3.8,22.8
N$28  (via drill 0.6)
  Top 0.28: R9.1 4.75,48.2 7.35,48.2 7.38,48.17 7.43,42.55 | 7.43,42.55 U4.12 | R10.2 v8.2,30.9 | v8.5,42.55 7.43,42.55
  Bottom 0.28: v8.2,30.9 8.2,42.55 v8.5,42.55
N$29  (via drill 0.6)
  Top 0.28: U4.6 8.05,33.4 8.05,32.05 8.15,31.95 9.55,31.95 v9.55,27.7 | v5.2,27.7 3.85,27.7 R11.2
  Bottom 0.28: v9.55,27.7 v5.2,27.7
N$30  (via drill 0.6)
  Top 0.28: U1.57 | U1.57 84.6,32.5 v84.6,35.35
  Bottom 0.28: v84.6,35.35 84.55,39.1 89.15,39.1 89.15,53.7 89.18,53.73 SV1.3
N$31  (via drill 0.6)
  Top 0.28: C24.1 93.95,27.9 93.95,30.4 v84.6,30.45 | v79.7,38.05 77.75,38.05 77.75,36.4 | 77.75,36.4 | 77.75,36.4 U1.63 | L3.2 76.5,47.4 78.85,47.4 v78.85,47.1
  Bottom 0.28: v84.6,30.45 81.85,30.45 81.85,38 81.8,38.05 80.7,38.05 | 80.7,38.05 v79.7,38.05 | v78.85,47.1 80.65,47.1 80.7,47.05 80.7,38.05
N$32  (via drill 0.6)
  Top 0.28: U1.30 arc90 U1.30 | U1.30 73.75,16.35 v74.2,15.15 | L7.2 74.65,10.5 | 74.65,10.5 C28.1 | v73.5,10.5 74.65,10.5
  Bottom 0.28: v74.2,15.15 74.2,13.1 73.5,13.1 v73.5,10.5
N$33
  Top 0.28: U1.74 | L4.2 72.21,47.54 72.19,47.56 C25.1 68.95,47.55 68.95,37.2 72,37.2 72.25,36.95 U1.74
N$34
  Top 0.28: U1.56 | U1.56 86.75,32 86.75,46.1 86.76,46.11 SV1.9 SV1.7
N$35
  Top 0.28: U1.54 | 87.6,31.45 | 87.6,31.45 87.6,43.55 87.62,43.57 SV1.11 | U1.54 83.45,31 83.45,31.4 83.5,31.45 87.6,31.45
N$36
  Top 0.28: U1.37 | U1.37 77.25,13.7 | C30.2 77.25,13.7 | 77.25,13.7 78.7,13.7 78.7,12.65 L8.2
N$37  (via drill 0.6)
  Top 0.28: R13.1 88.81,36.35 v91.05,36.35
  Bottom 0.28: v91.05,36.35 91.1,36.4 94.65,36.4 94.63,36.42 SV1.13 SV1.14
N$38  (via drill 0.6)
  Top 0.28: U1.11 | L6.2 60.25,29.55 61.05,29 62.85,29 | C27.1 60,36.65 v62.85,36.65 | v62.85,30.55 62.85,29 | 62.85,29 U1.11 | U1.11
  Bottom 0.28: v62.85,36.65 v62.85,30.55
N$39  (via drill 0.6)
  Top 0.28: U1.4 | U1.4 61.55,32.5 | 61.55,32.5 60,32.5 60,31.45 L5.2 | C26.1 v61.55,38.8 | v61.55,33.5 61.55,32.5
  Bottom 0.28: v61.55,38.8 v61.55,33.5
N$40
  Top 0.28: C29.2 66.45,19.9 65.65,19.9 | 65.65,19.9 L9.2 | U1.20 | U1.20 65.95,24.5 65.65,24.2 65.65,19.9
N$41
  Top 0.28: C23.1 89.86,27.79 L2.2 87.74,27.95 85.75,27.95 85.7,28 85.7,28.85 85.55,29 82.4,29 81.9,28.5 81.25,28.5 | 81.25,28.5 | 81.25,28.5 U1.49
N$42  (via drill 0.6)
  Top 0.28: U1.10 | v64.65,30.55 64.65,29.5 U1.10 | v64.75,39.6 R12.2 | R12.2 67.8,39.75 | SV1.2 95.9,54.95 67.7,54.95 67.7,39.6 R12.2 | U1.10
  Bottom 0.28: v64.65,30.55 v64.75,39.6
N$44  (via drill 0.6)
  Top 0.28: U1.58 | U1.58 83.25,33 v83.25,33.45
  Bottom 0.28: v83.25,33.45 83.25,51.9 83.2,56.2 83.22,56.22 SV1.1
N$45
  Top 0.28: U3.3 U3.2 81.95,14.25 81.95,19.95 78.25,19.95 78.25,20.05 U1.39
N$46
  Top 0.9: D1.A L10.2
N$47  (via drill 0.6)
  Top 0.28: C35.1 41.4,39.9 v41.45,39.85 | U$1.13 39.85,30.25 v41.55,30.25 44.55,30.25 44.55,28.45 C37.1 C36.1 | C38.1 R17.2 39.45,41.55 | U$1.10 37.95,27.85 v37.45,27.85
  Top 0.9: D1.C 39.45,46.65 39.45,41.55 C35.1
  Bottom 0.28: v41.45,39.85 41.45,32.05 | 41.45,32.05 v41.55,30.25 | v37.45,27.85 41.35,27.85 41.35,28.85 42.95,28.85 42.95,32.05 41.45,32.05
N$50  (via drill 0.6)
  Top 0.28: C40.2 72.85,40.95 72.75,41.05 v71.05,41.05 | v66.35,41.05 R19.1
  Bottom 0.28: v71.05,41.05 v66.35,41.05
N$52
  Top 0.28: C38.2 48.5,43.75 R14.2
N$53
  Top 0.28: U$1.19 45.15,33.95 45.15,34.85 R14.1 R15.2 R16.2 R17.1
N$54
  Top 0.28: U1.67 75.75,36.85 75.05,37.55 73.35,37.55 C40.1
N$55
  Top 0.28: R16.1 42.55,39.35 42.55,36.45 38.45,36.45 U$1.21
N$56
  Top 0.28: R15.1 43.15,37.05 43.15,35.95 38.95,35.95 U$1.20
N$57
  Top 0.28: U$1.4 C39.2
N$58
  Top 0.28: U$1.17 51.45,32.95 51.45,39.65 50.85,39.65 50.85,42.95 52,42.95 R18.2
N$59
  Top 0.28: R19.2 58.3,41 R18.1 52.05,32.45 U$1.16
N$61  (via drill 0.6)
  Top 0.28: U$1.8 | U$1.8 36.95,29.45 35.25,29.45 v35.25,28.25
  Bottom 0.28: v35.25,28.25 PAD1.1
N$62  (via drill 0.6)
  Top 0.28: U$1.12 | U$1.12 38.95,26.85 v39.55,26.85
  Bottom 0.28: v39.55,26.85 PAD2.1
RTS  (via drill 0.6)
  Top 0.28: U2.3 U2.2 81.95,39.78 81.95,42.35 79.2,42.35 79.15,42.3 v79.15,39.95 | v75.05,39.95 75.05,38.1 75.35,38.1 76.25,37.15 76.25,36.4 | 76.25,36.4 | 76.25,36.4 U1.66
  Bottom 0.28: v79.15,39.95 v75.05,39.95
VCC  (via drill 0.6)  (1 unrouted)
  Top 0.28: L6.1 58.23,31.43 L5.1 58.2,31.46 v58.2,33 | v63.3,23.55 63.31,23.54 L9.1 | L9.1 61.11,17.7 R4.2 | v55.65,22.95 51.45,18.75 R2.2 | v75.6,3.6 83.25,3.6 U3.8 L8.1 C3.1 90.5,12.4 90.5,19.75 | v75.6,7.15 L7.1 | 87.9,26 L2.1 87.9,22.1 87.95,22.05 90.35,22.05 C31.1 90.5,19.75 | L9.1 63.3,19.89 v63.3,16.35 | 90.5,19.75 95.4,19.75 95.4,31.2 92.6,31.2 92.6,38.15 v92.55,38.2 88.8,38.2 R13.2 | L4.1 74.37,45.83 74.39,45.81 L3.1 76.42,45.8 80.85,45.8 80.84,45.8 U2.8 80.7,45.21 80.65,51.2 v90.35,51.2 | C14.1 C15.1 24.45,44.95 | 24.45,44.95 26.45,45 arc-116 C16.1 C17.1 C18.1 30.5,45.5 32.55,45.5 32.55,53.85 55.65,53.85 55.65,46.35 | 24.45,30.35 24.45,27.95 C34.1 28.05,27.95 v31.55,27.95 | 24.45,30.35 24.45,44.95 | C21.1 R7.2 v6.35,18.1 | v12.8,26.05 12.8,30.4 17.7,30.4 17.7,30.35 18.4,30.35 | v9.65,26.05 9.65,24.2 C22.1 | U4.5 7.38,31.75 7.15,31.75 v7.15,28.75 | 12.85,26.05 14.3,26.05 14.3,18.15 14.25,18.1 v12.9,18.1 | 36.95,39.95 36.95,39.9 C32.1 37.45,39.9 | 35.15,39.95 C33.2 | 55.65,46.35 v55.65,45.5 | U$1.24 | U$1.24 36.95,35.75 35.55,35.75 | 35.55,35.75 35.55,33.95 U$1.1 | U$1.1 | U$1.18 50.25,33.45 | 50.25,33.45 | 50.25,33.45 50.25,46.35 55.65,46.35 | U$1.6 U$1.5 31.55,31.95 v31.55,30.95 | 35.55,35.75 31.85,35.75 31.85,39.95 | 18.4,30.35 24.45,30.35 | L1.2 18.4,30.37 18.4,30.35
  Top 0.9: 35.15,39.95 31.85,39.95 30.6,39.95 C18.1 | 37.45,39.9 37.45,50.45 L10.1
  Top 1: 36.95,39.95 35.15,39.95
  Bottom 0.28: v58.2,33 58.15,33.05 55.65,33.05 | 55.65,33.05 55.65,23.55 | 55.65,23.55 v63.3,23.55 | 55.65,23.55 v55.65,22.95 | v75.6,3.6 75.6,5.85 | 75.6,5.85 v75.6,7.15 | v63.3,16.35 69.55,16.35 69.55,7.15 70.85,5.85 75.6,5.85 | v92.55,38.2 92.6,38.25 92.6,51.2 | 92.6,51.2 92.69,51.19 SV1.5 | v90.35,51.2 92.6,51.2 | v12.8,26.05 11,26.05 | 11,26.05 v9.65,26.05 | v6.35,18.1 v12.9,18.1 | v7.15,28.75 11,28.75 11,26.05 | 55.65,33.05 v55.65,45.5 | v31.55,30.95 v31.55,27.95